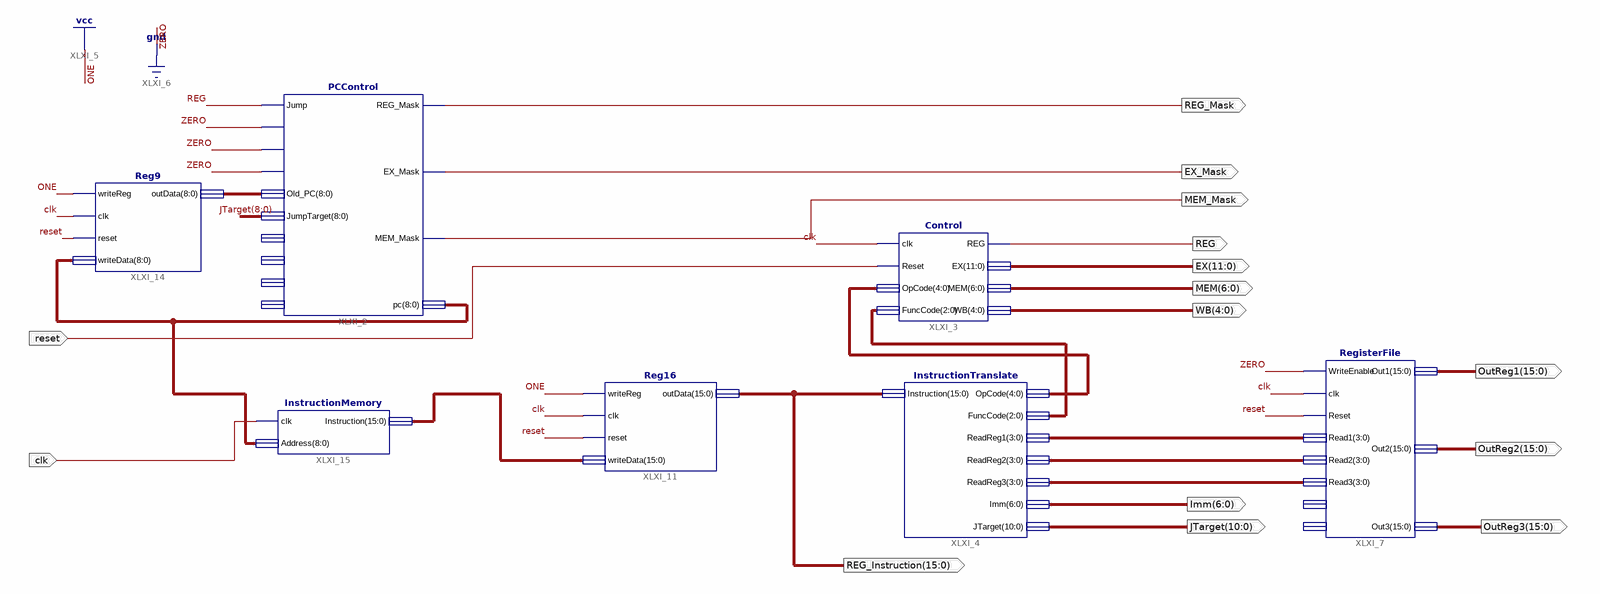
[diagram p0: schematic sheet 1]
// Xilinx ISE schematic BitEpicnessSch.sch (spartan3) as structural Verilog: 7 symbols, 15 ports
module BitEpicnessSch (
  input  clk,
  input  reset,
  output REG,
  output REG_Mask,
  output EX_Mask,
  output MEM_Mask,
  output [11:0] EX,
  output [6:0] MEM,
  output [4:0] WB,
  output [6:0] Imm,
  output [10:0] JTarget,
  output [15:0] OutReg1,
  output [15:0] OutReg2,
  output [15:0] OutReg3,
  output [15:0] REG_Instruction
);

  wire [2:0] XLXN_8;
  wire [3:0] ReadReg1, ReadReg2, ReadReg3;
  wire [4:0] XLXN_7;
  wire [8:0] XLXN_75, XLXN_77;
  wire [15:0] XLXN_52;

  PCControl XLXI_2 (
    .Jump(REG), .JumpRegister(1'b0), .Branch(1'b0), .ALUOverflow(1'b0), .Old_PC(XLXN_77),
    .JumpTarget(JTarget[8:0]), .REG_Mask(REG_Mask), .EX_Mask(EX_Mask), .MEM_Mask(MEM_Mask), .pc(XLXN_75));  // open: JumpRegisterTarget, BranchType, ALUOutput, BranchTarget
  Control XLXI_3 (.clk(clk), .Reset(reset), .OpCode(XLXN_7), .FuncCode(XLXN_8), .REG(REG), .EX(EX), .MEM(MEM), .WB(WB));
  RegisterFile XLXI_7 (
    .WriteEnable(1'b0), .clk(clk), .Reset(reset), .Read1(ReadReg1), .Read2(ReadReg2), .Read3(ReadReg3),
    .Out1(OutReg1), .Out2(OutReg2), .Out3(OutReg3));  // open: WriteReg, Data
  InstructionTranslate XLXI_4 (
    .Instruction(REG_Instruction), .OpCode(XLXN_7), .FuncCode(XLXN_8), .ReadReg1(ReadReg1),
    .ReadReg2(ReadReg2), .ReadReg3(ReadReg3), .Imm(Imm), .JTarget(JTarget));
  Reg16 XLXI_11 (.writeReg(1'b1), .clk(clk), .reset(reset), .writeData(XLXN_52), .outData(REG_Instruction));
  Reg9 XLXI_14 (.writeReg(1'b1), .clk(clk), .reset(reset), .writeData(XLXN_75), .outData(XLXN_77));
  InstructionMemory XLXI_15 (.clk(clk), .Address(XLXN_75), .Instruction(XLXN_52));
endmodule
